# Altium schematic sheet Power.SchDoc: Power
size A4 portrait; SheetNumber: 2; SheetTotal: 5; Cel: Ehh; Projektant: Teodor
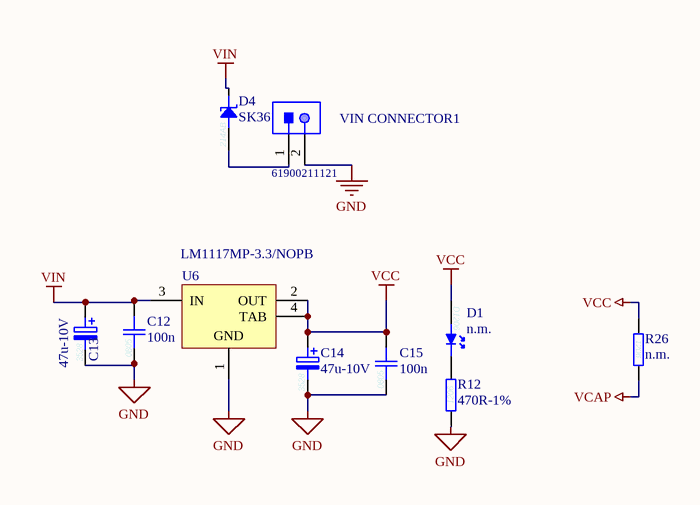
[diagram p0: Power.SchDoc]

## Parts
C12  100n  [0805C]
C13  47u-10V  [3528-SMDB]
C14  47u-10V  [3528-SMDB]
C15  100n  [0805C]
D1  n.m.  [D1206]  (no BOM)
D4  SK36  [DO214AB]
R12  470R-1%  [1206R]
R26  n.m.  [1206R]  (no BOM)
U6  LM1117MP-3.3/NOPB  [DCY0004A_L]
VIN_CONNECTOR1  61900211121  [61900211121]

## Nets
GND: C12.2 C13.2 C14.2 C15.2 R12.2 U6.1(GND) VIN_CONNECTOR1.2
VCAP: R26.1
VCC: C14.1 C15.1 D1.2(A) R26.2 U6.2(OUT) U6.4(TAB)
VIN: C12.1 C13.1 D4.1(K) U6.3(IN)
NetD1_1: D1.1(K) R12.1
NetD4_2: D4.2(A) VIN_CONNECTOR1.1

## Notes on the sheet
- Tytuł:
- Rozmiar:
- Data:
- A4
- Designed by:
- Czas:
- Część
- z
- (in symbol 47u-10V  3528) 3528
- (in symbol 100n  0805) 0805
- (in symbol 470R-1%  1206) 1206
- (in symbol n.m.  1206) 1206
- (in symbol n.m.  D1206) D1206
- (in symbol SK36  DO214AB) 214AB

## Library data of the parts
C12 C15 = 100n  0805: Kond. ceramiczny X7R  50V  10%; Indeks: 5566; Nazwa: 100n
C13 C14 = 47u-10V  3528: Kond. tantalowy  B  10V  20%; Indeks: 4032; Nazwa: 47u-10V
D1 = n.m.  D1206: Dioda LED; Index: -; Nazwa: n.m.
D4 = SK36  DO214AB: Dioda Schottky  60V  IF=3A  VF=0,75V; Index: 9145; Nazwa: SK36
R12 = 470R-1%  1206: Rezystor 0,25W; Nazwa: 470R-1%
R26 = n.m.  1206: Rezystor 0,25W; Indeks: -; Nazwa: n.m.
U6 = CMP-0062-01638-4: 800mA Low-Dropout Linear Regulator, 4-pin SOT-223, Pb-Free; Manufacturer: Texas Instruments; CompType: LDO IC; PackageTopMarking: XYTT*N05A; High-Reliability: Y; PowerWise: N; ComponentLink1URL: http://www.ti.com/general/docs/lit/getliterature.tsp?genericPartNumber=LM1117-N&fileType=pdf; PinCount: 4; PackageDescription: Molded SOT-223, 6.50 x 3.56 x 1.6mm Body, 4 Lead, 2.3mm Pitch; Code_IPC: SOT223-4; PartNumber: LM1117MP-3.3/NOPB; Code_JEDEC: TO-261-AA; RoHS: Y; PackageReference: DCY0004A; ComponentLink1Description: Datasheet URL
VIN_CONNECTOR1 = CMP-1502-00584-1: Male Locking Header WR-WTB, THT, Vertical, pitch 2.54 mm, 1 x 2 position; Manufacturer: Wurth Elektronik; Position: 1x2; Contact Resistance: 20mOhm; Working Voltage: 250VAC; Pitch: 2.54mm; Gender: Male; Part Number: 61900211121; Mounting Technology: THT; Operating Temperature: -40to105degC; Orientation: Vertical; Packaging: Bag; Package Reference: 61900211121; Manufacturer URL: http://www.we-online.de; Datasheet URL: https://katalog.we-online.de/em/datasheet/6190xx11121.pdf; Publisher: WurthElektronik